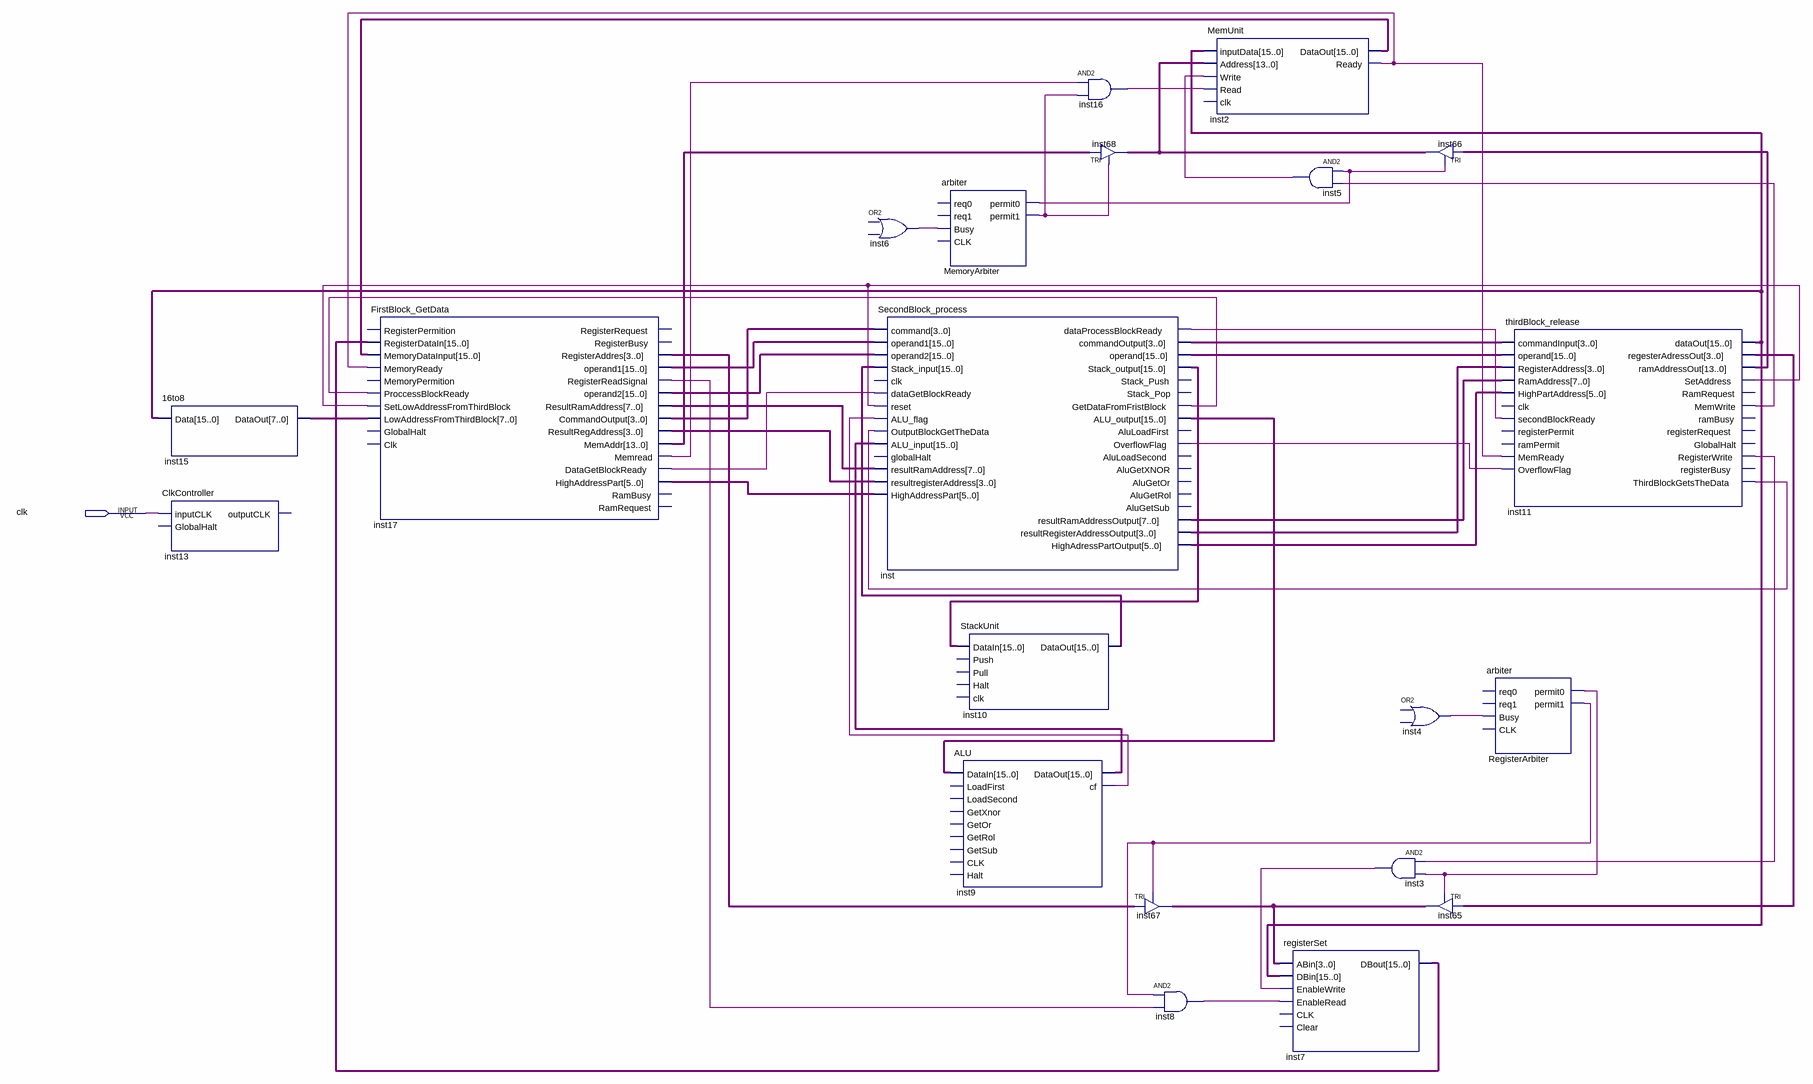
[diagram p0: schematic sheet]
// Quartus schematic MainBoard_without_some_pins.bdf as structural Verilog: 21 symbols, 1 pins
module MainBoard_without_some_pins (
  input  clk
);

  wire inst2_ready, inst3_out, inst4_out, inst5_out, inst6_out, inst8_out, inst9_cf, inst11_memwrite,
       inst11_registerwrite, inst11_setaddress, inst11_thirdblockgetsthedata, inst16_out,
       inst17_datagetblockready, inst17_memread, inst17_registerreadsignal, inst_dataprocessblockready,
       inst_getdatafromfristblock, inst_overflowflag, MemoryArbiter_permit0, MemoryArbiter_permit1,
       RegisterArbiter_permit0, RegisterArbiter_permit1;
  wire [3:0] inst11_regesteradressout, inst17_commandoutput, inst17_registeraddres, inst17_resultregaddress,
       inst67_out, inst_commandoutput, inst_resultregisteraddressoutput;
  wire [5:0] inst17_highaddresspart, inst_highadresspartoutput;
  wire [7:0] inst15_dataout, inst17_resultramaddress, inst_resultramaddressoutput;
  wire [13:0] inst11_ramaddressout, inst17_memaddr, inst68_out;
  wire [15:0] inst2_dataout, inst7_dbout, inst9_dataout, inst10_dataout, inst11_dataout, inst17_operand1,
       inst17_operand2, inst_alu_output, inst_operand, inst_stack_output;

  \16to8  inst15 (.Data(inst11_dataout), .DataOut(inst15_dataout));
  ClkController inst13 (.inputCLK(clk));  // open: GlobalHalt, outputCLK
  FirstBlock_GetData inst17 (
    .RegisterDataIn(inst7_dbout), .MemoryDataInput(inst2_dataout), .MemoryReady(inst2_ready),
    .ProccessBlockReady(inst_getdatafromfristblock), .SetLowAddressFromThirdBlock(inst11_setaddress),
    .LowAddressFromThirdBlock(inst15_dataout), .RegisterAddres(inst17_registeraddres),
    .operand1(inst17_operand1), .RegisterReadSignal(inst17_registerreadsignal), .operand2(inst17_operand2),
    .ResultRamAddress(inst17_resultramaddress), .CommandOutput(inst17_commandoutput),
    .ResultRegAddress(inst17_resultregaddress), .MemAddr(inst17_memaddr), .Memread(inst17_memread),
    .DataGetBlockReady(inst17_datagetblockready), .HighAddressPart(inst17_highaddresspart));  // open: RegisterPermition, MemoryPermition, GlobalHalt, Clk, RegisterRequest, RegisterBusy, RamBusy, RamRequest
  // OR2 inst6 has open pins: IN1=open, IN2=open, OUT=inst6_out
  SecondBlock_process inst (
    .command(inst17_commandoutput), .operand1(inst17_operand1), .operand2(inst17_operand2),
    .Stack_input(inst10_dataout), .dataGetBlockReady(inst17_datagetblockready), .reset(inst11_setaddress),
    .ALU_flag(inst9_cf), .OutputBlockGetTheData(inst11_thirdblockgetsthedata), .ALU_input(inst9_dataout),
    .resultRamAddress(inst17_resultramaddress), .resultregisterAddress(inst17_resultregaddress),
    .HighAddressPart(inst17_highaddresspart), .dataProcessBlockReady(inst_dataprocessblockready),
    .commandOutput(inst_commandoutput), .operand(inst_operand), .Stack_output(inst_stack_output),
    .GetDataFromFristBlock(inst_getdatafromfristblock), .ALU_output(inst_alu_output),
    .OverflowFlag(inst_overflowflag), .resultRamAddressOutput(inst_resultramaddressoutput),
    .resultRegisterAddressOutput(inst_resultregisteraddressoutput),
    .HighAdressPartOutput(inst_highadresspartoutput));  // open: clk, globalHalt, Stack_Push, Stack_Pop, AluLoadFirst, AluLoadSecond, AluGetXNOR, AluGetOr, AluGetRol, AluGetSub
  arbiter MemoryArbiter (
    .Busy(inst6_out), .permit0(MemoryArbiter_permit0), .permit1(MemoryArbiter_permit1));  // open: req0, req1, CLK
  ALU inst9 (
    .DataIn(inst_alu_output), .DataOut(inst9_dataout), .cf(inst9_cf));  // open: LoadFirst, LoadSecond, GetXnor, GetOr, GetRol, GetSub, CLK, Halt
  StackUnit inst10 (.DataIn(inst_stack_output), .DataOut(inst10_dataout));  // open: Push, Pull, Halt, clk
  and inst16 (inst16_out, inst17_memread, MemoryArbiter_permit1);
  TRI inst68[13:0] (.IN(inst17_memaddr), .OE(MemoryArbiter_permit1), .OUT(inst68_out));
  TRI inst67[3:0] (.IN(inst17_registeraddres), .OE(RegisterArbiter_permit1), .OUT(inst67_out));
  and inst8 (inst8_out, RegisterArbiter_permit1, inst17_registerreadsignal);
  MemUnit inst2 (
    .inputData(inst11_dataout), .Address(inst68_out), .Write(inst5_out), .Read(inst16_out),
    .DataOut(inst2_dataout), .Ready(inst2_ready));  // open: clk
  and inst5 (inst5_out, MemoryArbiter_permit0, inst11_memwrite);
  registerSet inst7 (
    .ABin(inst67_out), .DBin(inst11_dataout), .EnableWrite(inst3_out), .EnableRead(inst8_out),
    .DBout(inst7_dbout));  // open: CLK, Clear
  // OR2 inst4 has open pins: IN1=open, IN2=open, OUT=inst4_out
  and inst3 (inst3_out, inst11_registerwrite, RegisterArbiter_permit0);
  TRI inst66[13:0] (.IN(inst11_ramaddressout), .OE(MemoryArbiter_permit0), .OUT(inst68_out));
  TRI inst65[3:0] (.IN(inst11_regesteradressout), .OE(RegisterArbiter_permit0), .OUT(inst67_out));
  thirdBlock_release inst11 (
    .commandInput(inst_commandoutput), .operand(inst_operand),
    .RegisterAddress(inst_resultregisteraddressoutput), .RamAddress(inst_resultramaddressoutput),
    .HighPartAddress(inst_highadresspartoutput), .secondBlockReady(inst_dataprocessblockready),
    .MemReady(inst2_ready), .OverflowFlag(inst_overflowflag), .dataOut(inst11_dataout),
    .regesterAdressOut(inst11_regesteradressout), .ramAddressOut(inst11_ramaddressout),
    .SetAddress(inst11_setaddress), .MemWrite(inst11_memwrite), .RegisterWrite(inst11_registerwrite),
    .ThirdBlockGetsTheData(inst11_thirdblockgetsthedata));  // open: clk, registerPermit, ramPermit, RamRequest, ramBusy, registerRequest, GlobalHalt, registerBusy
  arbiter RegisterArbiter (
    .Busy(inst4_out), .permit0(RegisterArbiter_permit0), .permit1(RegisterArbiter_permit1));  // open: req0, req1, CLK
endmodule
